# Altium schematic sheet StudentForce_MIC.SchDoc
size 420 x 297 mm; DocumentNumber: Микрофон; SheetNumber: 3; Format: A3
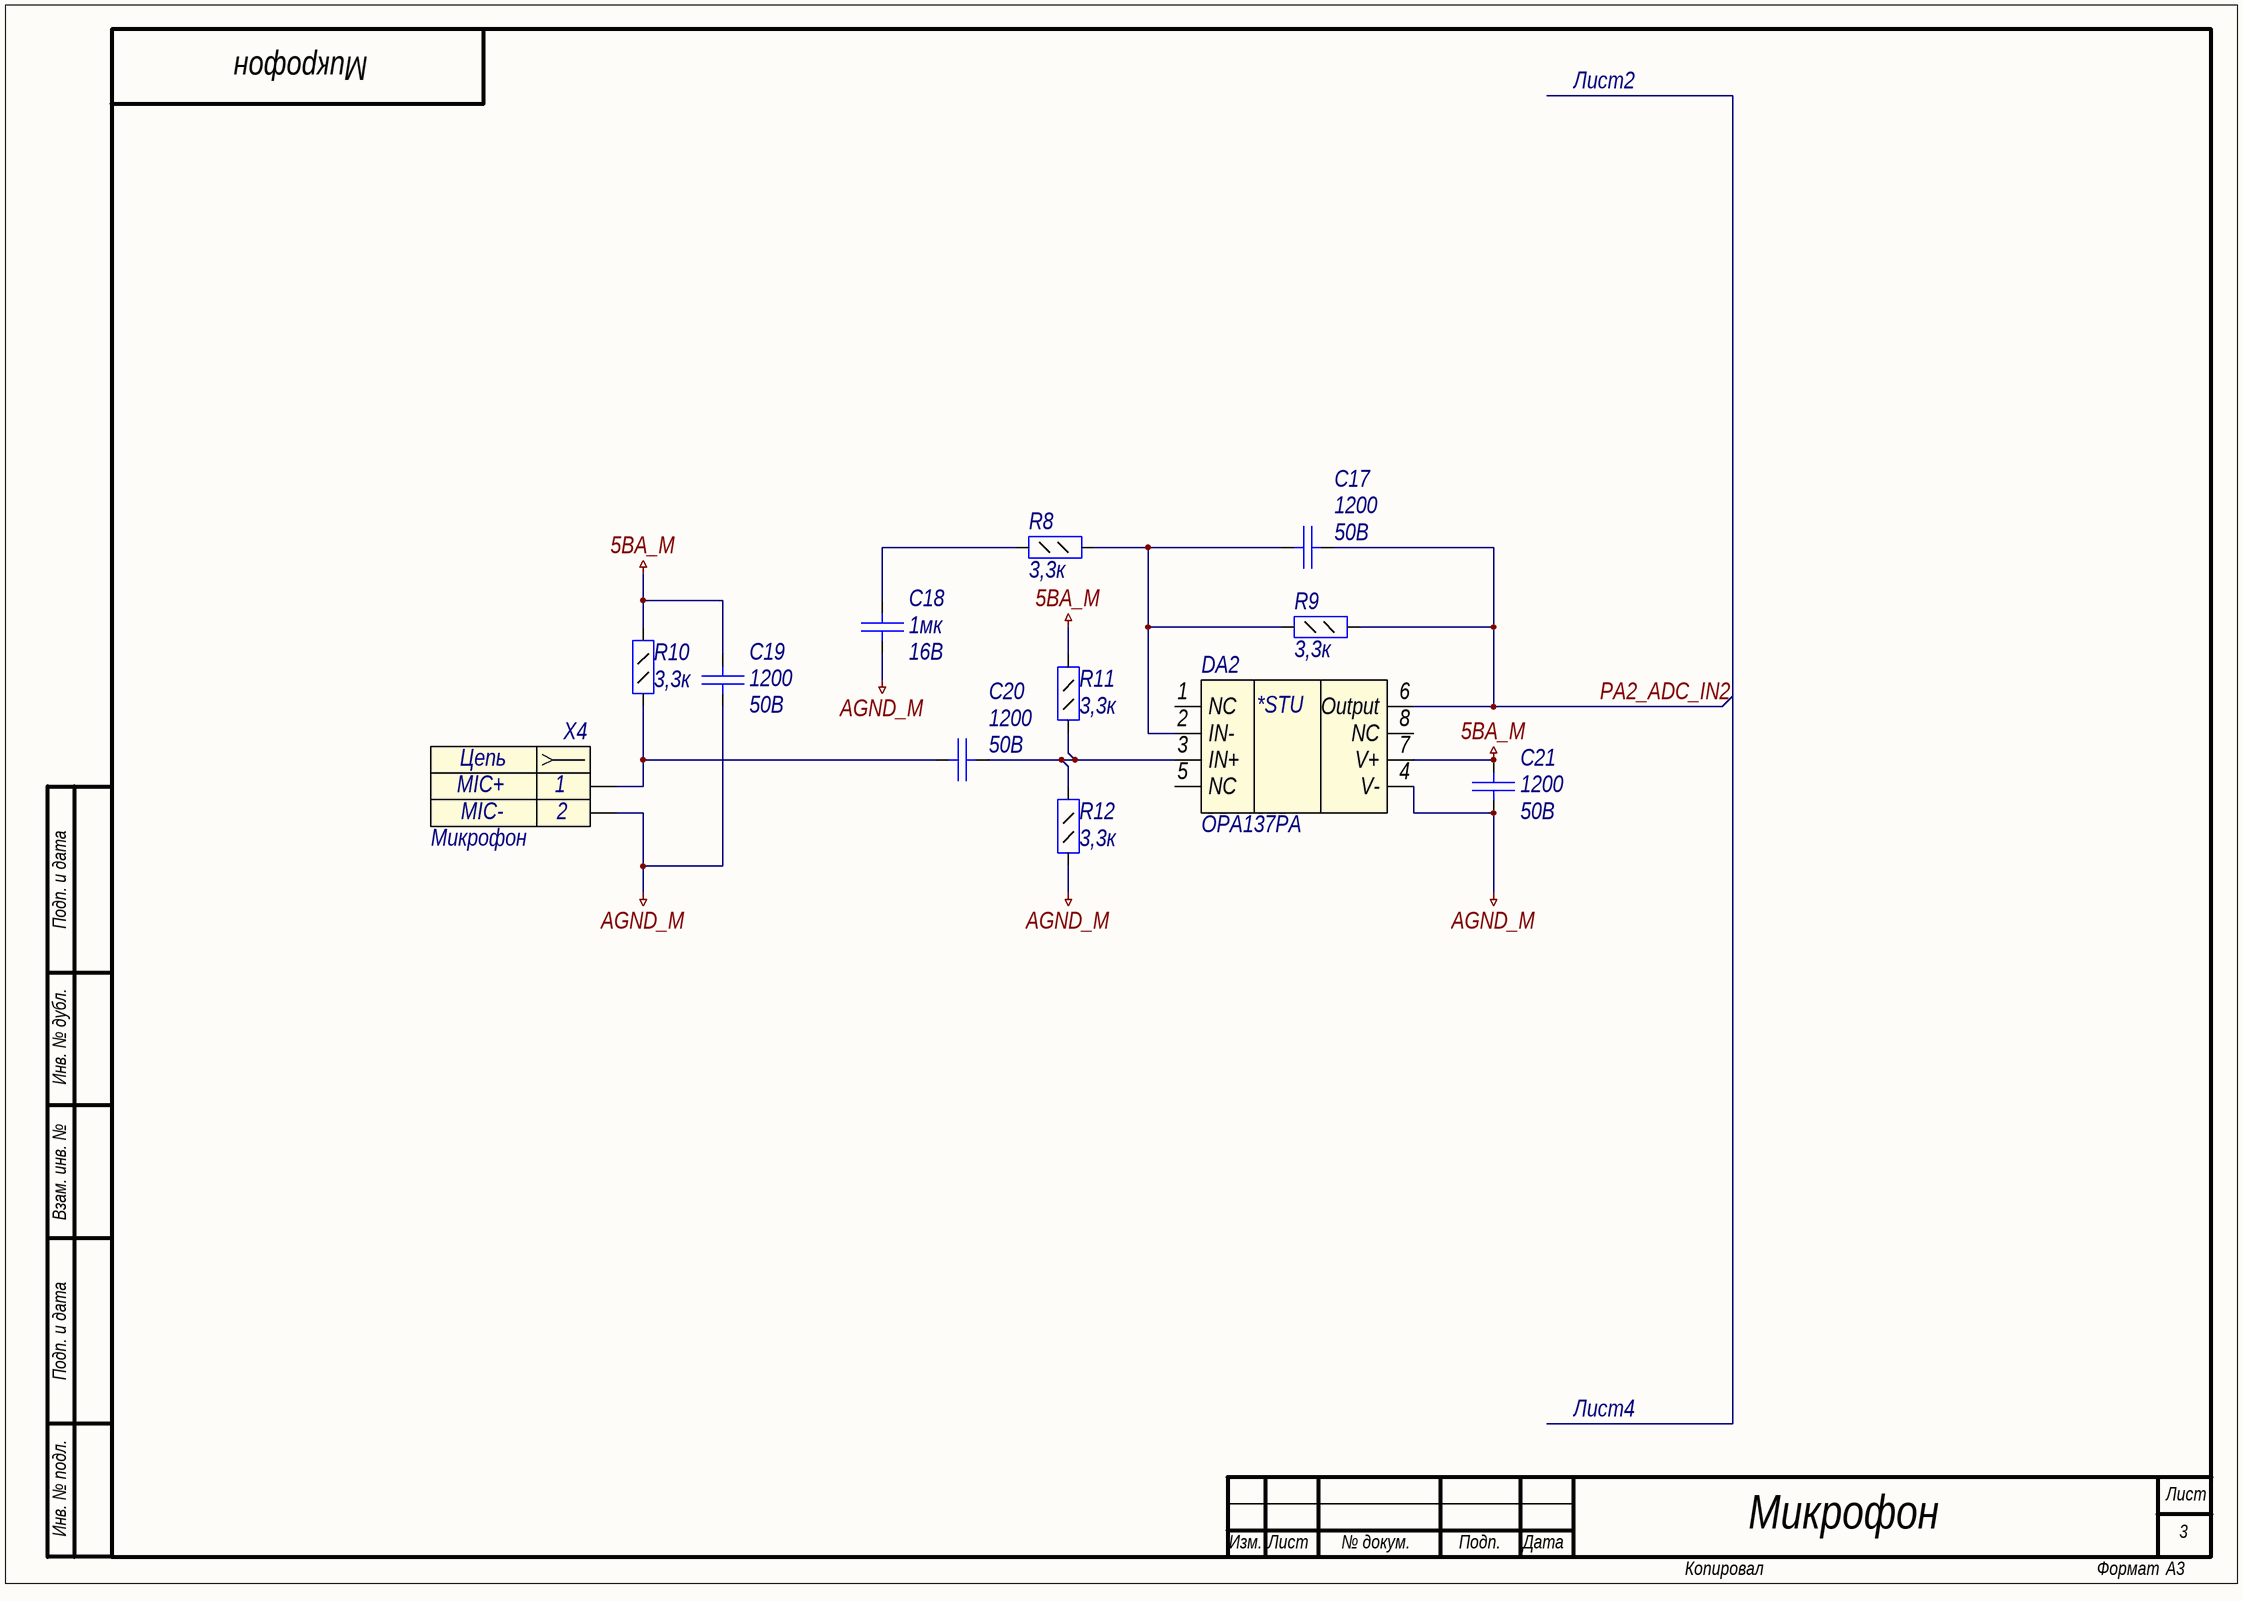
[diagram p0: StudentForce_MIC.SchDoc]

## Parts
C17  value 1200  Voltage: 50В  [C0805]  (hidden comment: Capacitor)
C18  value 1мк  Voltage: 16B  [C0805]  (hidden comment: Capacitor)
C19  value 1200  Voltage: 50В  [C0805]  (hidden comment: Capacitor)
C20  value 1200  Voltage: 50В  [C0805]  (hidden comment: Capacitor)
C21  value 1200  Voltage: 50В  [C0805]  (hidden comment: Capacitor)
DA2  OPA137PA  [DIP8]
R8  value 3,3к  [R0805]  (hidden comment: Resistor_0,125Вт)
R9  value 3,3к  [R0805]  (hidden comment: Resistor_0,125Вт)
R10  value 3,3к  [R0805]  (hidden comment: Resistor_0,125Вт)
R11  value 3,3к  [R0805]  (hidden comment: Resistor_0,125Вт)
R12  value 3,3к  [R0805]  (hidden comment: Resistor_0,125Вт)
X4  Микрофон  [CWF-2R]

## Nets
5BA_M: C19.1 C21.1 DA2.7(V+) R10.2 R11.2
AGND_M: C18.1 C19.2 C21.2 DA2.4(V-) R12.1 X4.2
PA2_ADC_IN2: C17.1 DA2.6(Output) R9.2
NetC17_2: C17.2 DA2.2(IN-) R8.2 R9.1
NetC18_2: C18.2 R8.1
NetC20_1: C20.1 DA2.3(IN+) R11.1 R12.2
NetC20_2: C20.2 R10.1 X4.1

Not connected (* = marked no-connect by the designer): DA2 1(NC) 5(NC) 8(NC)

## Notes on the sheet
- Лист2
- Подп. и дата
- Инв. № дубл.
- Взам. инв. №
- Лист4
- Инв. № подл.
- Лист
- Изм.
- № докум.
- Подп.
- Дата
- Копировал
- Формат
- (in symbol amp11) *STU
- (in symbol connect7) Цепь

## Library data of the parts
C17 C19-C21 = cap166: Конденсатор; Part Name: Ceramic; Part Number: GRM216R71H122K; Manufacture: Murata; id: cap166; TKE: X7R
C18 = cap149: Конденсатор; Part Name: Ceramic; Manufacture: Murata; Part Number: GRM21BR71C105K; id: cap149; TKE: X7R
DA2 = amp11: FET-INPUT OPERATIONAL AMPLIFIERS; Part Name: FET-INPUT Amplifier; Manufacture: Texas Instruments; id: amp11; Rail-to-rail: yes; Supply Voltage: 4,5-36B; Bandwidth: 1МГц; Input Bias Current: 100pA; CMRR: 76-84dB; PSRR: 80,92dB; Offset voltage: 2,5mB; Channels: 1; Part Number: OPA137PA
R8-R12 = res85: Резистор; Manufacture: Yageo; Part Number: RC0805FR-072K3; id: res85; Accuracy: 0.01; Part Name: Resistor; Power: 0,125Вт
X4 = connect7: Разъем - 2 конт. розетка; Part Name: CWF-2R type A; Part Number: DS1069-2 MR-A; Manufacture: Ningbo connfly electronic; Contact_1: MIC+; Contact_2: MIC-; Etch: 2,5mm; id: connect7